# Altium schematic sheet led_test.SchDoc
size A4
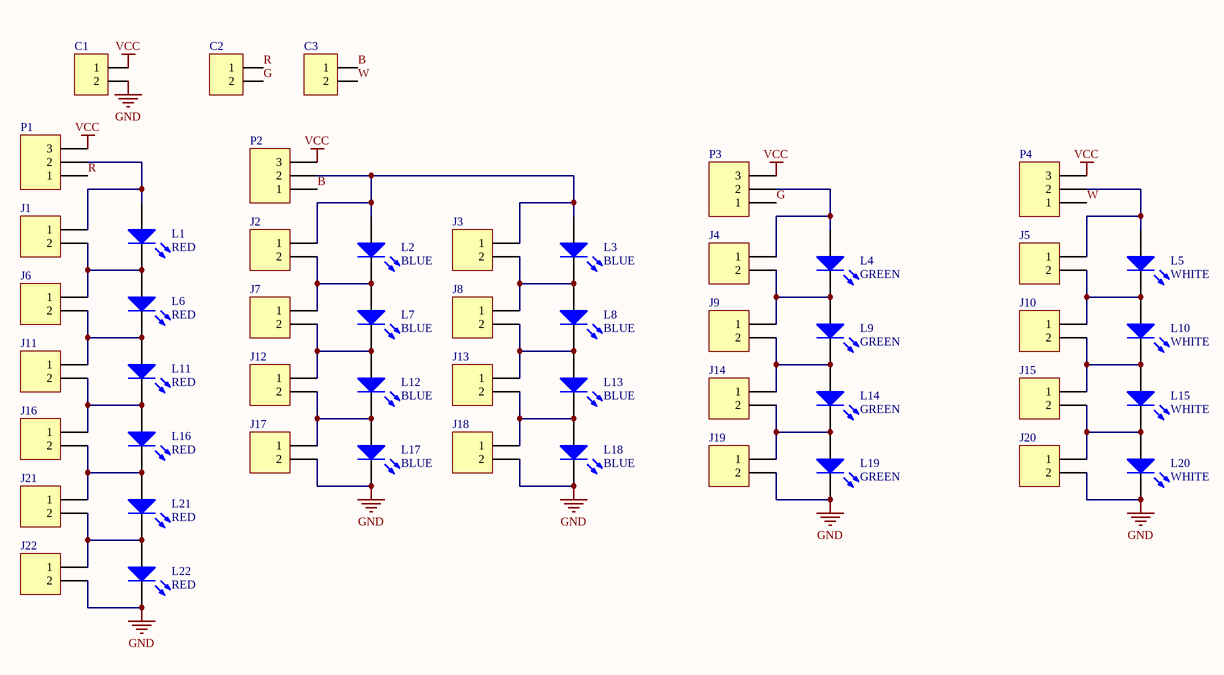
[diagram p0: led_test.SchDoc]

## Parts
C1  WE-Terminal Blocks Screw Type 691216510002  [691216510002]  (value not drawn)
C2  WE-Terminal Blocks Screw Type 691216510002  [691216510002]  (value not drawn)
C3  WE-Terminal Blocks Screw Type 691216510002  [691216510002]  (value not drawn)
J1  Header 2  [HDR1X2]  (value not drawn)
J2  Header 2  [HDR1X2]  (value not drawn)
J3  Header 2  [HDR1X2]  (value not drawn)
J4  Header 2  [HDR1X2]  (value not drawn)
J5  Header 2  [HDR1X2]  (value not drawn)
J6  Header 2  [HDR1X2]  (value not drawn)
J7  Header 2  [HDR1X2]  (value not drawn)
J8  Header 2  [HDR1X2]  (value not drawn)
J9  Header 2  [HDR1X2]  (value not drawn)
J10  Header 2  [HDR1X2]  (value not drawn)
J11  Header 2  [HDR1X2]  (value not drawn)
J12  Header 2  [HDR1X2]  (value not drawn)
J13  Header 2  [HDR1X2]  (value not drawn)
J14  Header 2  [HDR1X2]  (value not drawn)
J15  Header 2  [HDR1X2]  (value not drawn)
J16  Header 2  [HDR1X2]  (value not drawn)
J17  Header 2  [HDR1X2]  (value not drawn)
J18  Header 2  [HDR1X2]  (value not drawn)
J19  Header 2  [HDR1X2]  (value not drawn)
J20  Header 2  [HDR1X2]  (value not drawn)
J21  Header 2  [HDR1X2]  (value not drawn)
J22  Header 2  [HDR1X2]  (value not drawn)
L1  RED  [1W LED]
L2  BLUE  [1W LED]
L3  BLUE  [1W LED]
L4  GREEN  [1W LED]
L5  WHITE  [1W LED]
L6  RED  [1W LED]
L7  BLUE  [1W LED]
L8  BLUE  [1W LED]
L9  GREEN  [1W LED]
L10  WHITE  [1W LED]
L11  RED  [1W LED]
L12  BLUE  [1W LED]
L13  BLUE  [1W LED]
L14  GREEN  [1W LED]
L15  WHITE  [1W LED]
L16  RED  [1W LED]
L17  BLUE  [1W LED]
L18  BLUE  [1W LED]
L19  GREEN  [1W LED]
L20  WHITE  [1W LED]
L21  RED  [1W LED]
L22  RED  [1W LED]
P1  Header 3  [HDR1X3]  (value not drawn)
P2  Header 3  [HDR1X3]  (value not drawn)
P3  Header 3  [HDR1X3]  (value not drawn)
P4  Header 3  [HDR1X3]  (value not drawn)

## Nets
GND: C1.2 J17.2 J18.2 J19.2 J20.2 J22.2 L17.2(K) L18.2(K) L19.2(K) L20.2(K) L22.2(K)
VCC: C1.1 P1.3 P2.3 P3.3 P4.3
B: C3.1 P2.1
G: C2.2 P3.1
R: C2.1 P1.1
W: C3.2 P4.1
NetJ1_1: J1.1 L1.1(A) P1.2
NetJ1_2: J1.2 J6.1 L1.2(K) L6.1(A)
NetJ2_1: J2.1 J3.1 L2.1(A) L3.1(A) P2.2
NetJ2_2: J2.2 J7.1 L2.2(K) L7.1(A)
NetJ3_2: J3.2 J8.1 L3.2(K) L8.1(A)
NetJ4_1: J4.1 L4.1(A) P3.2
NetJ4_2: J4.2 J9.1 L4.2(K) L9.1(A)
NetJ5_1: J5.1 L5.1(A) P4.2
NetJ5_2: J5.2 J10.1 L5.2(K) L10.1(A)
NetJ6_2: J6.2 J11.1 L6.2(K) L11.1(A)
NetJ7_2: J7.2 J12.1 L7.2(K) L12.1(A)
NetJ8_2: J8.2 J13.1 L8.2(K) L13.1(A)
NetJ9_2: J9.2 J14.1 L9.2(K) L14.1(A)
NetJ10_2: J10.2 J15.1 L10.2(K) L15.1(A)
NetJ11_2: J11.2 J16.1 L11.2(K) L16.1(A)
NetJ12_2: J12.2 J17.1 L12.2(K) L17.1(A)
NetJ13_2: J13.2 J18.1 L13.2(K) L18.1(A)
NetJ14_2: J14.2 J19.1 L14.2(K) L19.1(A)
NetJ15_2: J15.2 J20.1 L15.2(K) L20.1(A)
NetJ16_2: J16.2 J21.1 L16.2(K) L21.1(A)
NetJ21_2: J21.2 J22.1 L21.2(K) L22.1(A)

## Library data of the parts
C1-C3 = WE-Terminal Blocks Screw Type 691216510002: WR-TBL Terminal block - serie 2165 - 5.08 mm; Manufacturer: W¨¹rth Elektronik eiSos GmbH; ComponentLink1 Description: Manufacturer; ComponentLink2 Description: Datasheet; NoPins: 2; Created Date: 27 Novenber 2013; partNo: 691216510002; ComponentLink1URL: http://www.we-online.com; ComponentLink2URL: http://katalog.we-online.de/em/datasheet/6912165100xx.pdf; Created by: Karrer Zheng
J1-J22 = Header 2: Header, 2-Pin; LatestRevisionDate: 17-Jul-2002; LatestRevisionNote: Re-released for DXP Platform.; Publisher: Altium Limited
L1-L22 = LED2
P1-P4 = Header 3: Header, 3-Pin; LatestRevisionDate: 17-Jul-2002; LatestRevisionNote: Re-released for DXP Platform.; Publisher: Altium Limited